# Altium project JCD-858D HOT AIR STATION.PrjPcb
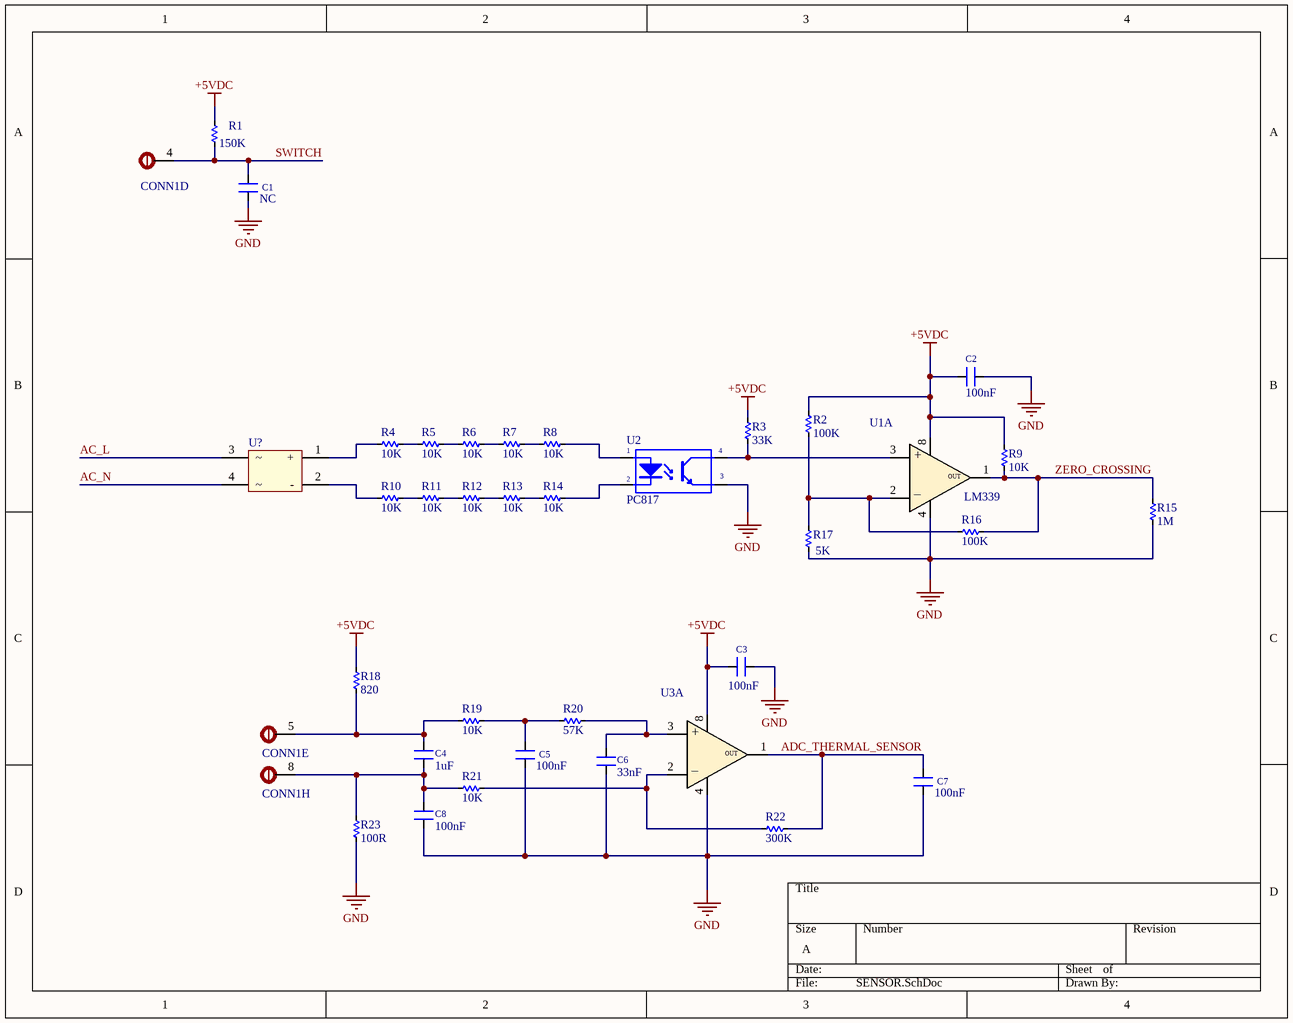
[diagram p0: SENSOR.SchDoc]
3 sheets, 94 parts. Net scope: global (net labels, ports and power ports of the same name join across sheets).
Board file: MAIN.PcbDoc
Sheets:
  SENSOR.SchDoc
  POWER_SUPPLY.SchDoc
  MCU_ATMEGA328P.SchDoc

## Sheet SENSOR.SchDoc
size A; SheetNumber: 1; SheetTotal: 3

### Parts
C1  NC  [SM-CAP-0805]
C2  100nF  [SM-CAP-0805]
C3  100nF  [SM-CAP-0805]
C4  1uF  [SM-CAP-0805]
C5  100nF  [SM-CAP-0805]
C6  33nF  [SM-CAP-0805]
C7  100nF  [SM-CAP-0805]
C8  100nF  [SM-CAP-0805]
CONN1  GX-16 CONNECTOR  [GX-16]  (value not drawn)  (parts D,E,H of 8)
R1  150K  [RES-SMD-0603]
R2  100K  [RES-SMD-0805]
R3  33K  [RES-SMD-0603]
R4  10K  [RES-SMD-0805]
R5  10K  [RES-SMD-0805]
R6  10K  [RES-SMD-0805]
R7  10K  [RES-SMD-0805]
R8  10K  [RES-SMD-0805]
R9  10K  [RES-SMD-0805]
R10  10K  [RES-SMD-0805]
R11  10K  [RES-SMD-0805]
R12  10K  [RES-SMD-0805]
R13  10K  [RES-SMD-0805]
R14  10K  [RES-SMD-0805]
R15  1M  [RES-SMD-0805]
R16  100K  [RES-SMD-0805]
R17  5K  [RES-SMD-0805]
R18  820  [RES-SMD-0603]
R19  10K  [RES-SMD-0603]
R20  57K  [RES-SMD-0603]
R21  10K  [RES-SMD-0603]
R22  300K  [RES-SMD-0603]
R23  100R  [RES-SMD-0603]
U1  LM339  [SOP-8]  (part A of 2)
U2  PC817  [PC817]
U3  MCP6002  [SOP-8]  (value not drawn)  (part A of 2)
U?  (no value)  [Diode Bridge SMD]

### Nets
+5VDC: C2.2 C3.2 R1.1 R2.1 R3.1 R9.2 R18.1 U1.8 U3.8
GND: C1.1 C2.1 C3.1 C5.1 C6.1 C7.1 C8.1 R15.1 R17.2 R23.2 U1.4 U2.3(E) U3.4
AC_L: U?.3
AC_N: U?.4
ADC_THERMAL_SENSOR: C7.2 R22.1 U3.1
SWITCH: C1.2 CONN1.4 R1.2
ZERO_CROSSING: R9.1 R15.2 R16.2 U1.1
NetC4_1: C4.1 C8.2 CONN1.8 R21.2 R23.1
NetC4_2: C4.2 CONN1.5 R18.2 R19.2
NetC5_2: C5.2 R19.1 R20.2
NetC6_2: C6.2 R20.1 U3.3
NetR2_2: R2.2 R16.1 R17.1 U1.2
NetR3_2: R3.2 U1.3 U2.4(C)
NetR4_1: R4.1 R5.2
NetR4_2: R4.2 U?.1(+)
NetR5_1: R5.1 R6.2
NetR6_1: R6.1 R7.2
NetR7_1: R7.1 R8.2
NetR8_1: R8.1 U2.1(A)
NetR10_1: R10.1 R11.2
NetR10_2: R10.2 U?.2(-)
NetR11_1: R11.1 R12.2
NetR12_1: R12.1 R13.2
NetR13_1: R13.1 R14.2
NetR14_1: R14.1 U2.2(K)
NetR21_1: R21.1 R22.2 U3.2

### Notes on the sheet
- (in symbol MCP6002, part A) +; OUT; _

### Library data of the parts
C1-C8 = CAP SMD: Value: 0,1uF/300V; Designed by: VanDungEvn
R1-R23 = Res-SMD: Resistor; Manufacturer: Generic Components; Class: Passive; Published: 08/06/2000; Publisher: Altium Hobart Technology Centre
U1 = MCP6002
U2 = PC817: Single Opto; Value: PC817
U? = Diode Bridge smd 1A: Diode Bridge

## Sheet POWER_SUPPLY.SchDoc
size A4; SheetNumber: 2; SheetTotal: 3
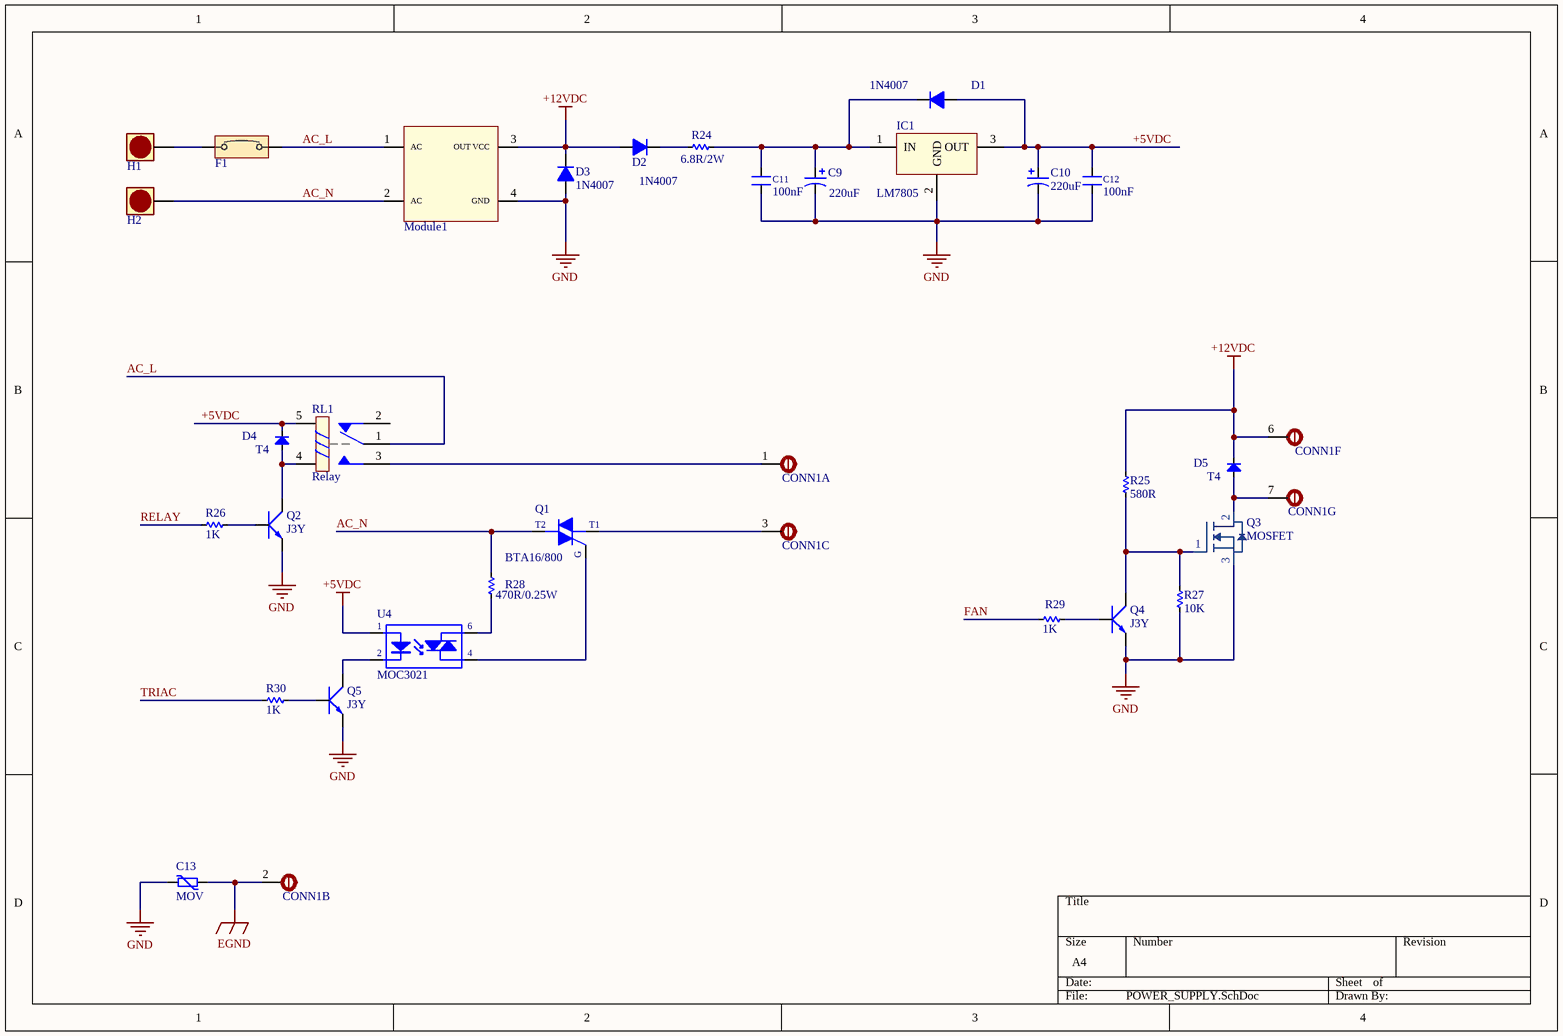
[diagram p1: POWER_SUPPLY.SchDoc]

### Parts
C9  220uF  [C8MM]
C10  220uF  [C8MM]
C11  100nF  [SM-Cap-1206]
C12  100nF  [SM-Cap-1206]
C13  MOV  [14D271K]
CONN1  GX-16 CONNECTOR  [GX-16]  (value not drawn)  (parts A,B,C,F,G of 8)
D1  1N4007  [DO-213AA]
D2  1N4007  [DO-213AA]
D3  1N4007  [DO-213AA]
D4  T4  [SOD123]
D5  T4  [SOD123]
F1  FUSE  [FUSE 5X20MM]  (value not drawn)
H1  JP1P  [PW-JP]  (value not drawn)
H2  JP1P  [PW-JP]  (value not drawn)
IC1  LM7805  [QTO-220H3]
Module1  AC DC Powersupply  [VNPT_ADAPTER]  (value not drawn)
Q1  BTA16/800  [TO220H2]
Q2  J3Y  [SOT23B]
Q3  MOSFET  [TO-252]
Q4  J3Y  [SOT23B]
Q5  J3Y  [SOT23B]
R24  6.8R/2W  [R2WD]
R25  580R  [RES-SMD-0805]
R26  1K  [RES-SMD-0805]
R27  10K  [RES-SMD-0603]
R28  470R/0.25W  [RES-1/4W]
R29  1K  [RES-SMD-0805]
R30  1K  [RES-SMD-0805]
RL1  Relay  [RL-05VDC-10A]
U4  MOC3021  [DIP6/W0.3 - MOC3021]

### Nets
+5VDC: C10.1 C12.1 D1.1 D4.K IC1.3(OUT) RL1.5 U4.1(A)
+12VDC: CONN1.6 D2.1 D3.2 D5.K Module1.3(OUT_VCC) R25.1
EGND: C13.1 CONN1.2
GND: C9.2 C10.2 C11.2 C12.2 C13.2 D3.1 IC1.2(GND) Module1.4(GND) Q2.1(E) Q3.3 Q4.1(E) Q5.1(E) R27.2
AC_L: F1.2 Module1.1(AC) RL1.1
AC_N: H2.1 Module1.2(AC) Q1.2(M2) R28.1
FAN: R29.2
RELAY: R26.2
TRIAC: R30.2
NetC9_1: C9.1 C11.1 D1.2 IC1.1(IN) R24.1
NetCONN1_1: CONN1.1 RL1.3
NetCONN1_3: CONN1.3 Q1.1(M1)
NetCONN1_7: CONN1.7 D5.A Q3.2
NetD2_2: D2.2 R24.2
NetD4_A: D4.A Q2.3(C) RL1.4
NetF1_1: F1.1 H1.1
NetQ1_3: Q1.3(G) U4.4(E)
NetQ2_2: Q2.2(B) R26.1
NetQ3_1: Q3.1 Q4.3(C) R25.2 R27.1
NetQ4_2: Q4.2(B) R29.1
NetQ5_2: Q5.2(B) R30.1
NetQ5_3: Q5.3(C) U4.2(K)
NetR28_2: R28.2 U4.6(C)

Not connected (* = marked no-connect by the designer): RL1 2

### Notes on the sheet
- (in symbol BTA12-600_TRIAC) T2; T1

### Library data of the parts
C9 C10 = CAP-Radial: Published: 8-Jun-2000; LatestRevisionDate: 17-Jul-2002; LatestRevisionNote: Re-released for DXP Platform.; PackageReference: POLAR0.8; Publisher: Altium Limited; value: ?
C11 C12 = CAP SMD: as C1 on sheet SENSOR
D1-D3 = Diode  1N4007: Diode 1A; pin to pad: 1>A 2>K; Value: 1N4007
D4 D5 = Diode-1N4007 -A4: Default Diode; Code - JEDEC: DO-214-AB; Value: 1N5007; Published: 8-Jun-2000; Revision: July-2002: Re-released for DXP Platform.; Publisher: Altium Limited
IC1 = LM78xx: On ap +, from + 5 to + 24VDC; Value: LM7805
Q1 = BTA12-600_TRIAC: Silicon Bidirectional Triode Thyristor; Note: Pin 2 is electrically connected to Pin 4 (TAB); Published: 29-Sep-2000; LatestRevisionDate: 17-Jul-2002; LatestRevisionNote: Re-released for DXP Platform.; DatasheetDocument: 1999; PackageReference: 369-03; Publisher: Altium Limited; Code_JEDEC: TO-251-AA; ComponentLink1Description: Manufacturer Link; ComponentLink1URL: http://www.motorola.com/
Q2 Q4 Q5 = 2N222: NPN 600mW, ECB; pin to pad: 1>2 2>1; Value: C1815
Q3 = MOSFET-N: MOSFET N chane
R24 R28 = Res_DIP: Res; Manufacturer: Generic Components; Class: Passive; SubClass: R; Published: 08/06/2000; Publisher: Altium Hobart Technology Centre
R25-R27 R29 R30 = Res-SMD: as R1 on sheet SENSOR; Published: 08/06/2000; Publisher: Altium Hobart Technology Centre
RL1 = Relay 5VDC: Relay SPDT 5 Pin; Value: Relay SPDT, 10A, 12V
U4 = MOC3021: Single Opto; Value: MOC3021

## Sheet MCU_ATMEGA328P.SchDoc: JDC 858D MAIN
size A4; DrawnBy: Huan; DocumentNumber: 1; Revision: 1.0; SheetNumber: 3; SheetTotal: 3
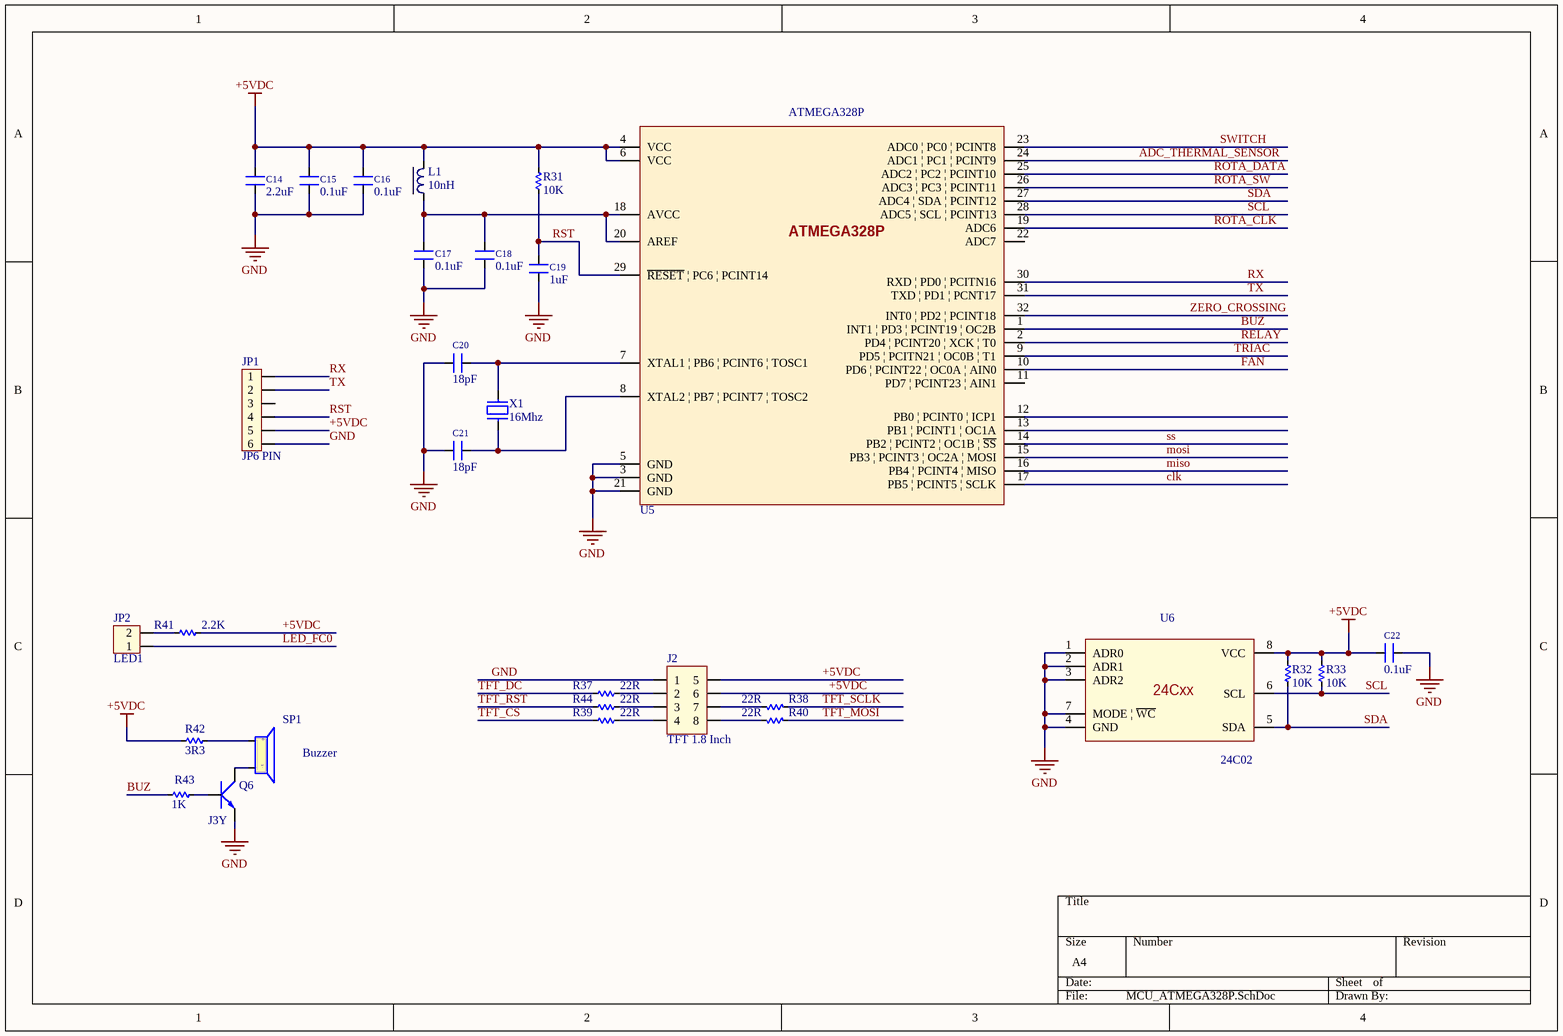
[diagram p2: MCU_ATMEGA328P.SchDoc]

### Parts
C14  2.2uF  [CN-SMD-1206]
C15  0.1uF  [CN-SMD-0805]
C16  0.1uF  [CN-SMD-0805]
C17  0.1uF  [CN-SMD-0805]
C18  0.1uF  [CN-SMD-0805]
C19  1uF  [CN-SMD-0805]
C20  18pF  [CN-SMD-0805]
C21  18pF  [CN-SMD-0805]
C22  0.1uF  [CN-SMD-0805]
J2  TFT 1.8 Inch  [JP4x2]
JP1  JP6 PIN  [JP6]
JP2  LED1  [CON2]
L1  10nH  [IN-SMD-0805]
Q6  J3Y  [SOT23B]
R31  10K  [RES-SMD-0603]
R32  10K  [RES-SMD-0603]
R33  10K  [RES-SMD-0603]
R37  22R  [RES-SMD-0603]
R38  22R  [RES-SMD-0603]
R39  22R  [RES-SMD-0603]
R40  22R  [RES-SMD-0603]
R41  2.2K  [RES-SMD-0603]
R42  3R3  [RES-SMD-0805]
R43  1K  [RES-SMD-0805]
R44  22R  [RES-SMD-0603]
SP1  Buzzer  [Buzzer]
U5  ATMEGA328P  [TQFP-32]
U6  24C02  [SOP-8]
X1  16Mhz  [XT-49S/DIP]

### Nets
+5VDC: C14.2 C15.2 C16.2 C22.2 J2.5 J2.6 JP1.5 L1.2 R31.1 R32.1 R33.1 R41.2 R42.1 U5.4(VCC) U5.6(VCC) U6.8(VCC)
GND: C14.1 C15.1 C16.1 C17.1 C18.1 C19.1 C20.2 C21.2 C22.1 J2.1 JP1.6 Q6.1(E) U5.3(GND) U5.5(GND) U5.21(GND) U6.1(ADR0) U6.2(ADR1) U6.3(ADR2) U6.4(GND) U6.7(MODE_|_~{WC})
ADC_THERMAL_SENSOR: U5.24(ADC1_|_PC1_|_PCINT9)
BUZ: R43.2 U5.1(INT1_|_PD3_|_PCINT19_|_OC2B)
clk: U5.17(PB5_|_PCINT5_|_SCLK)
FAN: U5.10(PD6_|_PCINT22_|_OC0A_|_AIN0)
LED_FC0: JP2.1
miso: U5.16(PB4_|_PCINT4_|_MISO)
mosi: U5.15(PB3_|_PCINT3_|_OC2A_|_MOSI)
RELAY: U5.2(PD4_|_PCINT20_|_XCK_|_T0)
ROTA_CLK: U5.19(ADC6)
ROTA_DATA: U5.25(ADC2_|_PC2_|_PCINT10)
ROTA_SW: U5.26(ADC3_|_PC3_|_PCINT11)
RST: C19.2 JP1.4 R31.2 U5.29(~{RESET}_|_PC6_|_PCINT14)
RX: JP1.1 U5.30(RXD_|_PD0_|_PCITN16)
SCL: R33.2 U5.28(ADC5_|_SCL_|_PCINT13) U6.6(SCL)
SDA: R32.2 U5.27(ADC4_|_SDA_|_PCINT12) U6.5(SDA)
ss: U5.14(PB2_|_PCINT2_|_OC1B_|_~{SS})
SWITCH: U5.23(ADC0_|_PC0_|_PCINT8)
TFT_CS: R39.1
TFT_DC: R37.1
TFT_MOSI: R40.1
TFT_RST: R44.1
TFT_SCLK: R38.1
TRIAC: U5.9(PD5_|_PCITN21_|_OC0B_|_T1)
TX: JP1.2 U5.31(TXD_|_PD1_|_PCNT17)
ZERO_CROSSING: U5.32(INT0_|_PD2_|_PCINT18)
NetC17_2: C17.2 C18.2 L1.1 U5.18(AVCC) U5.20(AREF)
NetC20_1: C20.1 U5.7(XTAL1_|_PB6_|_PCINT6_|_TOSC1) X1.1
NetC21_1: C21.1 U5.8(XTAL2_|_PB7_|_PCINT7_|_TOSC2) X1.2
NetJ2_2: J2.2 R37.2
NetJ2_3: J2.3 R44.2
NetJ2_4: J2.4 R39.2
NetJ2_7: J2.7 R38.2
NetJ2_8: J2.8 R40.2
NetJP2_2: JP2.2 R41.1
NetQ6_2: Q6.2(B) R43.1
NetQ6_3: Q6.3(C) SP1.2
NetR42_2: R42.2 SP1.1

Not connected (* = marked no-connect by the designer): JP1 3; U5 11(PD7_|_PCINT23_|_AIN1) 12(PB0_|_PCINT0_|_ICP1) 13(PB1_|_PCINT1_|_OC1A) 22(ADC7)

### Notes on the sheet
- (in symbol Buzzer_5V) +; -

### Library data of the parts
C14-C22 = CAP SMD: as C1 on sheet SENSOR
J2 = JP4x2: Connector 4x2; Value: Connector 4x2
JP1 = JP6: Value: JP7
JP2 = Con2: Connector 2; Value: Connector 2
L1 = inductor-SMD: Value: 150 mH
Q6 = 2N222: NPN 600mW, ECB; pin to pad: 1>2 2>1; Value: C1815
R31-R33 R37-R44 = Res-SMD: as R1 on sheet SENSOR; Published: 08/06/2000; Publisher: Altium Hobart Technology Centre
SP1 = Buzzer_5V
U6 = 24Cxx: SERIAL EEPROM
X1 = XTAL: crystal; Value: 4Mhz

## Nets that join several sheets
+5VDC: SENSOR (9 pins), POWER_SUPPLY (7 pins), MCU_ATMEGA328P (16 pins)
GND: SENSOR (13 pins), POWER_SUPPLY (13 pins), MCU_ATMEGA328P (20 pins)
AC_L: SENSOR (U?.3), POWER_SUPPLY (F1.2 Module1.1 RL1.1)
AC_N: SENSOR (U?.4), POWER_SUPPLY (H2.1 Module1.2 Q1.2 R28.1)
ADC_THERMAL_SENSOR: SENSOR (C7.2 R22.1 U3.1), MCU_ATMEGA328P (U5.24)
FAN: POWER_SUPPLY (R29.2), MCU_ATMEGA328P (U5.10)
RELAY: POWER_SUPPLY (R26.2), MCU_ATMEGA328P (U5.2)
SWITCH: SENSOR (C1.2 CONN1.4 R1.2), MCU_ATMEGA328P (U5.23)
TRIAC: POWER_SUPPLY (R30.2), MCU_ATMEGA328P (U5.9)
ZERO_CROSSING: SENSOR (R9.1 R15.2 R16.2 U1.1), MCU_ATMEGA328P (U5.32)